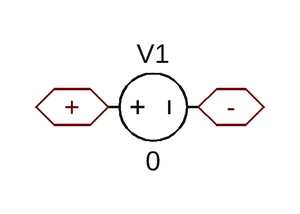
[diagram p0: schematic jumper2.asc]
jumper2.asc, the LTspice schematic file:
Version 4
SHEET 1 880 680
FLAG 160 128 +
IOPIN 160 128 BiDir
FLAG 240 128 -
IOPIN 240 128 BiDir
SYMBOL voltage 144 128 R270
WINDOW 0 32 56 VTop 2
WINDOW 3 -32 56 VBottom 2
SYMATTR InstName V1
SYMATTR Value 0

The netlist it stands for:
* jumper2.asc
V1 + - 0
.backanno
.end